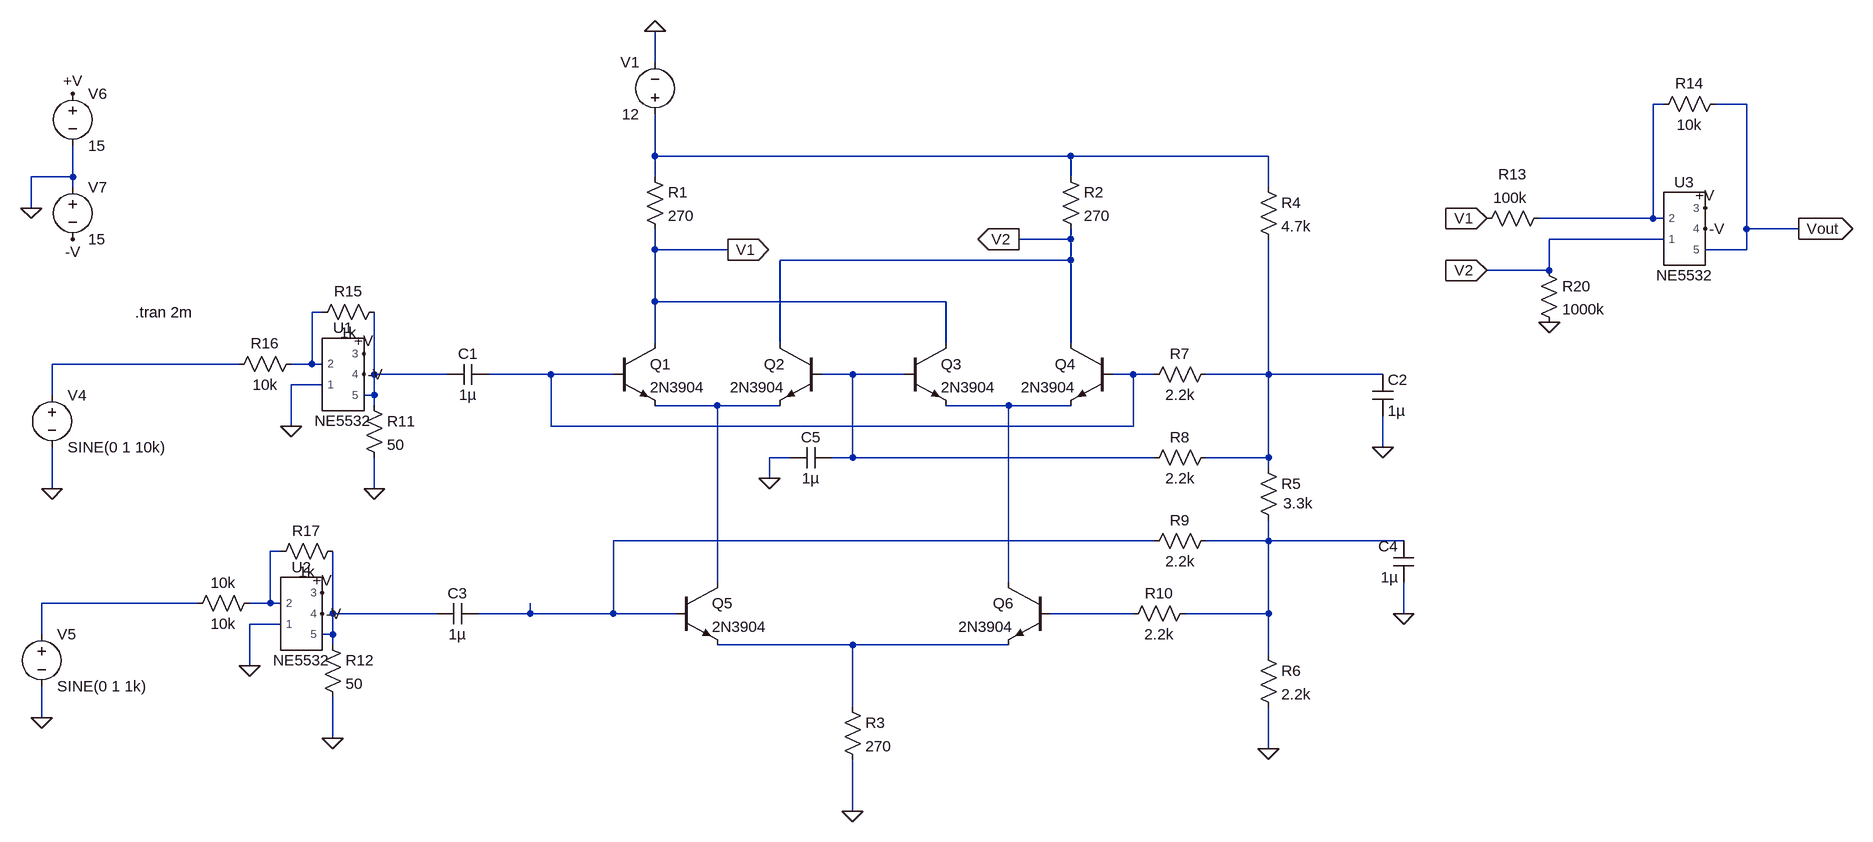
[diagram p0: schematic Multiplier_GILBERT_FINAL_last.asc]
Multiplier_GILBERT_FINAL_last.asc, the LTspice schematic file:
Version 4.1
SHEET 1 1648 1016
WIRE -224 -176 -224 -224
WIRE 1328 -112 1312 -112
WIRE 1456 -112 1408 -112
WIRE -224 -32 -224 -96
WIRE 416 -32 -224 -32
WIRE 720 -32 416 -32
WIRE -1120 0 -1120 -48
WIRE -1120 0 -1184 0
WIRE -224 0 -224 -32
WIRE 416 0 416 -32
WIRE -1120 16 -1120 0
WIRE 720 16 720 -32
WIRE -1184 48 -1184 0
WIRE 1312 64 1312 -112
WIRE 1312 64 1136 64
WIRE 1328 64 1312 64
WIRE 1456 80 1456 -112
WIRE 1536 80 1456 80
WIRE 416 96 416 80
WIRE 416 96 336 96
WIRE 1328 96 1152 96
WIRE -224 112 -224 80
WIRE -112 112 -224 112
WIRE 1456 112 1456 80
WIRE 1456 112 1392 112
WIRE 416 128 416 96
WIRE 416 128 -32 128
WIRE 1152 144 1152 96
WIRE 1152 144 1056 144
WIRE -224 192 -224 112
WIRE 224 192 -224 192
WIRE -736 208 -752 208
WIRE -224 256 -224 192
WIRE -32 256 -32 128
WIRE 224 256 224 192
WIRE 416 256 416 128
WIRE -864 288 -1152 288
WIRE -752 288 -752 208
WIRE -752 288 -784 288
WIRE -736 288 -752 288
WIRE -656 304 -656 208
WIRE -544 304 -656 304
WIRE -384 304 -480 304
WIRE -288 304 -384 304
WIRE 80 304 32 304
WIRE 160 304 80 304
WIRE 512 304 480 304
WIRE 544 304 512 304
WIRE 720 304 720 96
WIRE 720 304 624 304
WIRE 896 304 720 304
WIRE -736 320 -784 320
WIRE -1152 336 -1152 288
WIRE -656 336 -656 304
WIRE -656 336 -672 336
WIRE -656 352 -656 336
WIRE -128 352 -224 352
WIRE -32 352 -128 352
WIRE 320 352 224 352
WIRE 416 352 320 352
WIRE -784 384 -784 320
WIRE -384 384 -384 304
WIRE 512 384 512 304
WIRE 512 384 -384 384
WIRE 896 416 896 368
WIRE -16 432 -48 432
WIRE 80 432 80 304
WIRE 80 432 48 432
WIRE 544 432 80 432
WIRE 720 432 720 304
WIRE 720 432 624 432
WIRE 720 448 720 432
WIRE -48 464 -48 432
WIRE -1152 480 -1152 416
WIRE -656 480 -656 432
WIRE 544 560 -288 560
WIRE 720 560 720 528
WIRE 720 560 624 560
WIRE 928 560 720 560
WIRE -800 576 -816 576
WIRE -128 624 -128 352
WIRE 320 624 320 352
WIRE -928 656 -1168 656
WIRE -816 656 -816 576
WIRE -816 656 -848 656
WIRE -800 656 -816 656
WIRE -720 672 -720 576
WIRE -560 672 -720 672
WIRE -416 672 -416 656
WIRE -416 672 -496 672
WIRE -288 672 -288 560
WIRE -288 672 -416 672
WIRE -192 672 -288 672
WIRE 512 672 384 672
WIRE 720 672 720 560
WIRE 720 672 592 672
WIRE 928 672 928 624
WIRE -800 688 -848 688
WIRE -1168 704 -1168 656
WIRE -720 704 -720 672
WIRE -720 704 -736 704
WIRE -720 720 -720 704
WIRE 80 720 -128 720
WIRE 320 720 80 720
WIRE 720 736 720 672
WIRE -848 752 -848 688
WIRE 80 816 80 720
WIRE -1168 832 -1168 784
WIRE -720 864 -720 800
WIRE 720 880 720 816
WIRE 80 976 80 896
FLAG -224 -224 0
FLAG 720 880 0
FLAG 80 976 0
FLAG 896 416 0
FLAG 928 672 0
FLAG -48 464 0
FLAG -1152 480 0
FLAG -1168 832 0
FLAG -656 480 0
FLAG -720 864 0
FLAG -1184 48 0
FLAG -1120 -128 +V
FLAG -1120 96 -V
FLAG -784 384 0
FLAG -848 752 0
FLAG -112 112 V1
IOPIN -112 112 Out
FLAG 336 96 V2
IOPIN 336 96 Out
FLAG 1056 64 V1
IOPIN 1056 64 In
FLAG 1056 144 V2
IOPIN 1056 144 In
FLAG 1152 224 0
FLAG 1536 80 Vout
IOPIN 1536 80 Out
FLAG -736 640 +V
FLAG -672 272 +V
FLAG -672 304 -V
FLAG -736 672 -V
FLAG 1392 80 -V
FLAG 1392 48 +V
SYMBOL res -240 -16 R0
SYMATTR InstName R1
SYMATTR Value 270
SYMBOL res 400 -16 R0
SYMATTR InstName R2
SYMATTR Value 270
SYMBOL res 64 800 R0
SYMATTR InstName R3
SYMATTR Value 270
SYMBOL res 704 0 R0
SYMATTR InstName R4
SYMATTR Value 4.7k
SYMBOL res 704 432 R0
WINDOW 3 39 70 Left 2
SYMATTR Value 3.3k
SYMATTR InstName R5
SYMBOL res 704 720 R0
SYMATTR InstName R6
SYMATTR Value 2.2k
SYMBOL res 640 288 R90
WINDOW 0 0 56 VBottom 2
WINDOW 3 32 56 VTop 2
SYMATTR InstName R7
SYMATTR Value 2.2k
SYMBOL res 640 416 R90
WINDOW 0 0 56 VBottom 2
WINDOW 3 32 56 VTop 2
SYMATTR InstName R8
SYMATTR Value 2.2k
SYMBOL res 640 544 R90
WINDOW 0 0 56 VBottom 2
WINDOW 3 32 56 VTop 2
SYMATTR InstName R9
SYMATTR Value 2.2k
SYMBOL res 608 656 R90
WINDOW 0 0 56 VBottom 2
WINDOW 3 32 56 VTop 2
SYMATTR InstName R10
SYMATTR Value 2.2k
SYMBOL npn -288 256 R0
SYMATTR InstName Q1
SYMATTR Value 2N3904
SYMBOL npn 32 256 M0
SYMATTR InstName Q2
SYMATTR Value 2N3904
SYMBOL npn 160 256 R0
SYMATTR InstName Q3
SYMATTR Value 2N3904
SYMBOL npn 480 256 M0
SYMATTR InstName Q4
SYMATTR Value 2N3904
SYMBOL voltage -224 -80 R180
WINDOW 0 24 96 Left 2
WINDOW 3 24 16 Left 2
WINDOW 123 0 0 Left 0
WINDOW 39 0 0 Left 0
SYMATTR InstName V1
SYMATTR Value 12
SYMBOL voltage -1152 320 R0
WINDOW 123 0 0 Left 0
WINDOW 39 0 0 Left 0
SYMATTR InstName V4
SYMATTR Value SINE(0 1 10k)
SYMBOL voltage -1168 688 R0
WINDOW 123 0 0 Left 0
WINDOW 39 0 0 Left 0
SYMATTR InstName V5
SYMATTR Value SINE(0 1 1k)
SYMBOL npn -192 624 R0
SYMATTR InstName Q5
SYMATTR Value 2N3904
SYMBOL npn 384 624 M0
SYMATTR InstName Q6
SYMATTR Value 2N3904
SYMBOL cap -480 288 R90
WINDOW 0 0 32 VBottom 2
WINDOW 3 32 32 VTop 2
SYMATTR InstName C1
SYMATTR Value 1µ
SYMBOL cap 880 304 R0
SYMATTR InstName C2
SYMATTR Value 1µ
SYMBOL cap -496 656 R90
WINDOW 0 0 32 VBottom 2
WINDOW 3 32 32 VTop 2
SYMATTR InstName C3
SYMATTR Value 1µ
SYMBOL cap 944 624 R180
WINDOW 0 24 56 Left 2
WINDOW 3 24 8 Left 2
SYMATTR InstName C4
SYMATTR Value 1µ
SYMBOL cap 48 416 R90
WINDOW 0 0 32 VBottom 2
WINDOW 3 32 32 VTop 2
SYMATTR InstName C5
SYMATTR Value 1µ
SYMBOL res -672 336 R0
SYMATTR InstName R11
SYMATTR Value 50
SYMBOL res -736 704 R0
SYMATTR InstName R12
SYMATTR Value 50
SYMBOL voltage -1120 -144 R0
WINDOW 123 0 0 Left 0
WINDOW 39 0 0 Left 0
SYMATTR InstName V6
SYMATTR Value 15
SYMBOL voltage -1120 0 R0
WINDOW 123 0 0 Left 0
WINDOW 39 0 0 Left 0
SYMATTR InstName V7
SYMATTR Value 15
SYMBOL res -640 192 R90
WINDOW 0 0 56 VBottom 2
WINDOW 3 32 56 VTop 2
SYMATTR InstName R15
SYMATTR Value 1k
SYMBOL res -768 272 R90
WINDOW 0 0 56 VBottom 2
WINDOW 3 32 56 VTop 2
SYMATTR InstName R16
SYMATTR Value 10k
SYMBOL res -704 560 R90
WINDOW 0 0 56 VBottom 2
WINDOW 3 32 56 VTop 2
SYMATTR InstName R17
SYMATTR Value 1k
SYMBOL res -832 640 R90
WINDOW 0 0 56 VBottom 2
WINDOW 3 32 56 VTop 2
SYMATTR InstName 10k
SYMATTR Value 10k
SYMBOL res 1424 -128 R90
WINDOW 0 0 56 VBottom 2
WINDOW 3 32 56 VTop 2
SYMATTR InstName R14
SYMATTR Value 10k
SYMBOL res 1152 48 R90
WINDOW 0 -36 56 VBottom 2
WINDOW 3 -31 60 VTop 2
SYMATTR InstName R13
SYMATTR Value 100k
SYMBOL res 1136 128 R0
SYMATTR InstName R20
SYMATTR Value 1000k
SYMBOL NE5532 -704 304 R0
SYMATTR InstName U1
SYMBOL NE5532 -768 672 R0
SYMATTR InstName U2
SYMBOL NE5532 1360 80 R0
SYMATTR InstName U3
TEXT -1024 208 Left 2 !.tran 2m

The netlist it stands for:
* Multiplier_GILBERT_FINAL_last.asc
R1 N002 V1 270
R2 N002 V2 270
R3 N017 0 270
R4 N002 N008 4.7k
R5 N008 N012 3.3k
R6 N012 0 2.2k
R7 N008 N006 2.2k
R8 N008 N007 2.2k
R9 N012 N011 2.2k
R10 N012 N016 2.2k
Q1 V1 N006 N009 0 2N3904
Q2 V2 N007 N009 0 2N3904
Q3 V1 N007 N010 0 2N3904
Q4 V2 N006 N010 0 2N3904
V1 N002 0 12
V4 N004 0 SINE(0 1 10k)
V5 N014 0 SINE(0 1 1k)
Q5 N009 N011 N017 0 2N3904
Q6 N010 N016 N017 0 2N3904
C1 N006 N005 1µ
C2 N008 0 1µ
C3 N011 N015 1µ
C4 0 N012 1µ
C5 N007 0 1µ
R11 N005 0 50
R12 N015 0 50
V6 +V 0 15
V7 0 -V 15
R15 N005 N003 1k
R16 N003 N004 10k
R17 N015 N013 1k
R§10k N013 N014 10k
R14 Vout N001 10k
R13 N001 V1 100k
R20 V2 0 1000k
X§U1 0 N003 +V -V N005 NE5532  ; pins 1 2 3 4 5
X§U2 0 N013 +V -V N015 NE5532  ; pins 1 2 3 4 5
X§U3 V2 N001 +V -V Vout NE5532  ; pins 1 2 3 4 5
.model NPN NPN
.model PNP PNP
.lib standard.bjt
.tran 2m
.lib NE5532.lib
.backanno
.end